# Altium schematic sheet ESP32_MCU.SchDoc
size A3; SheetNumber: 2; SheetTotal: 3
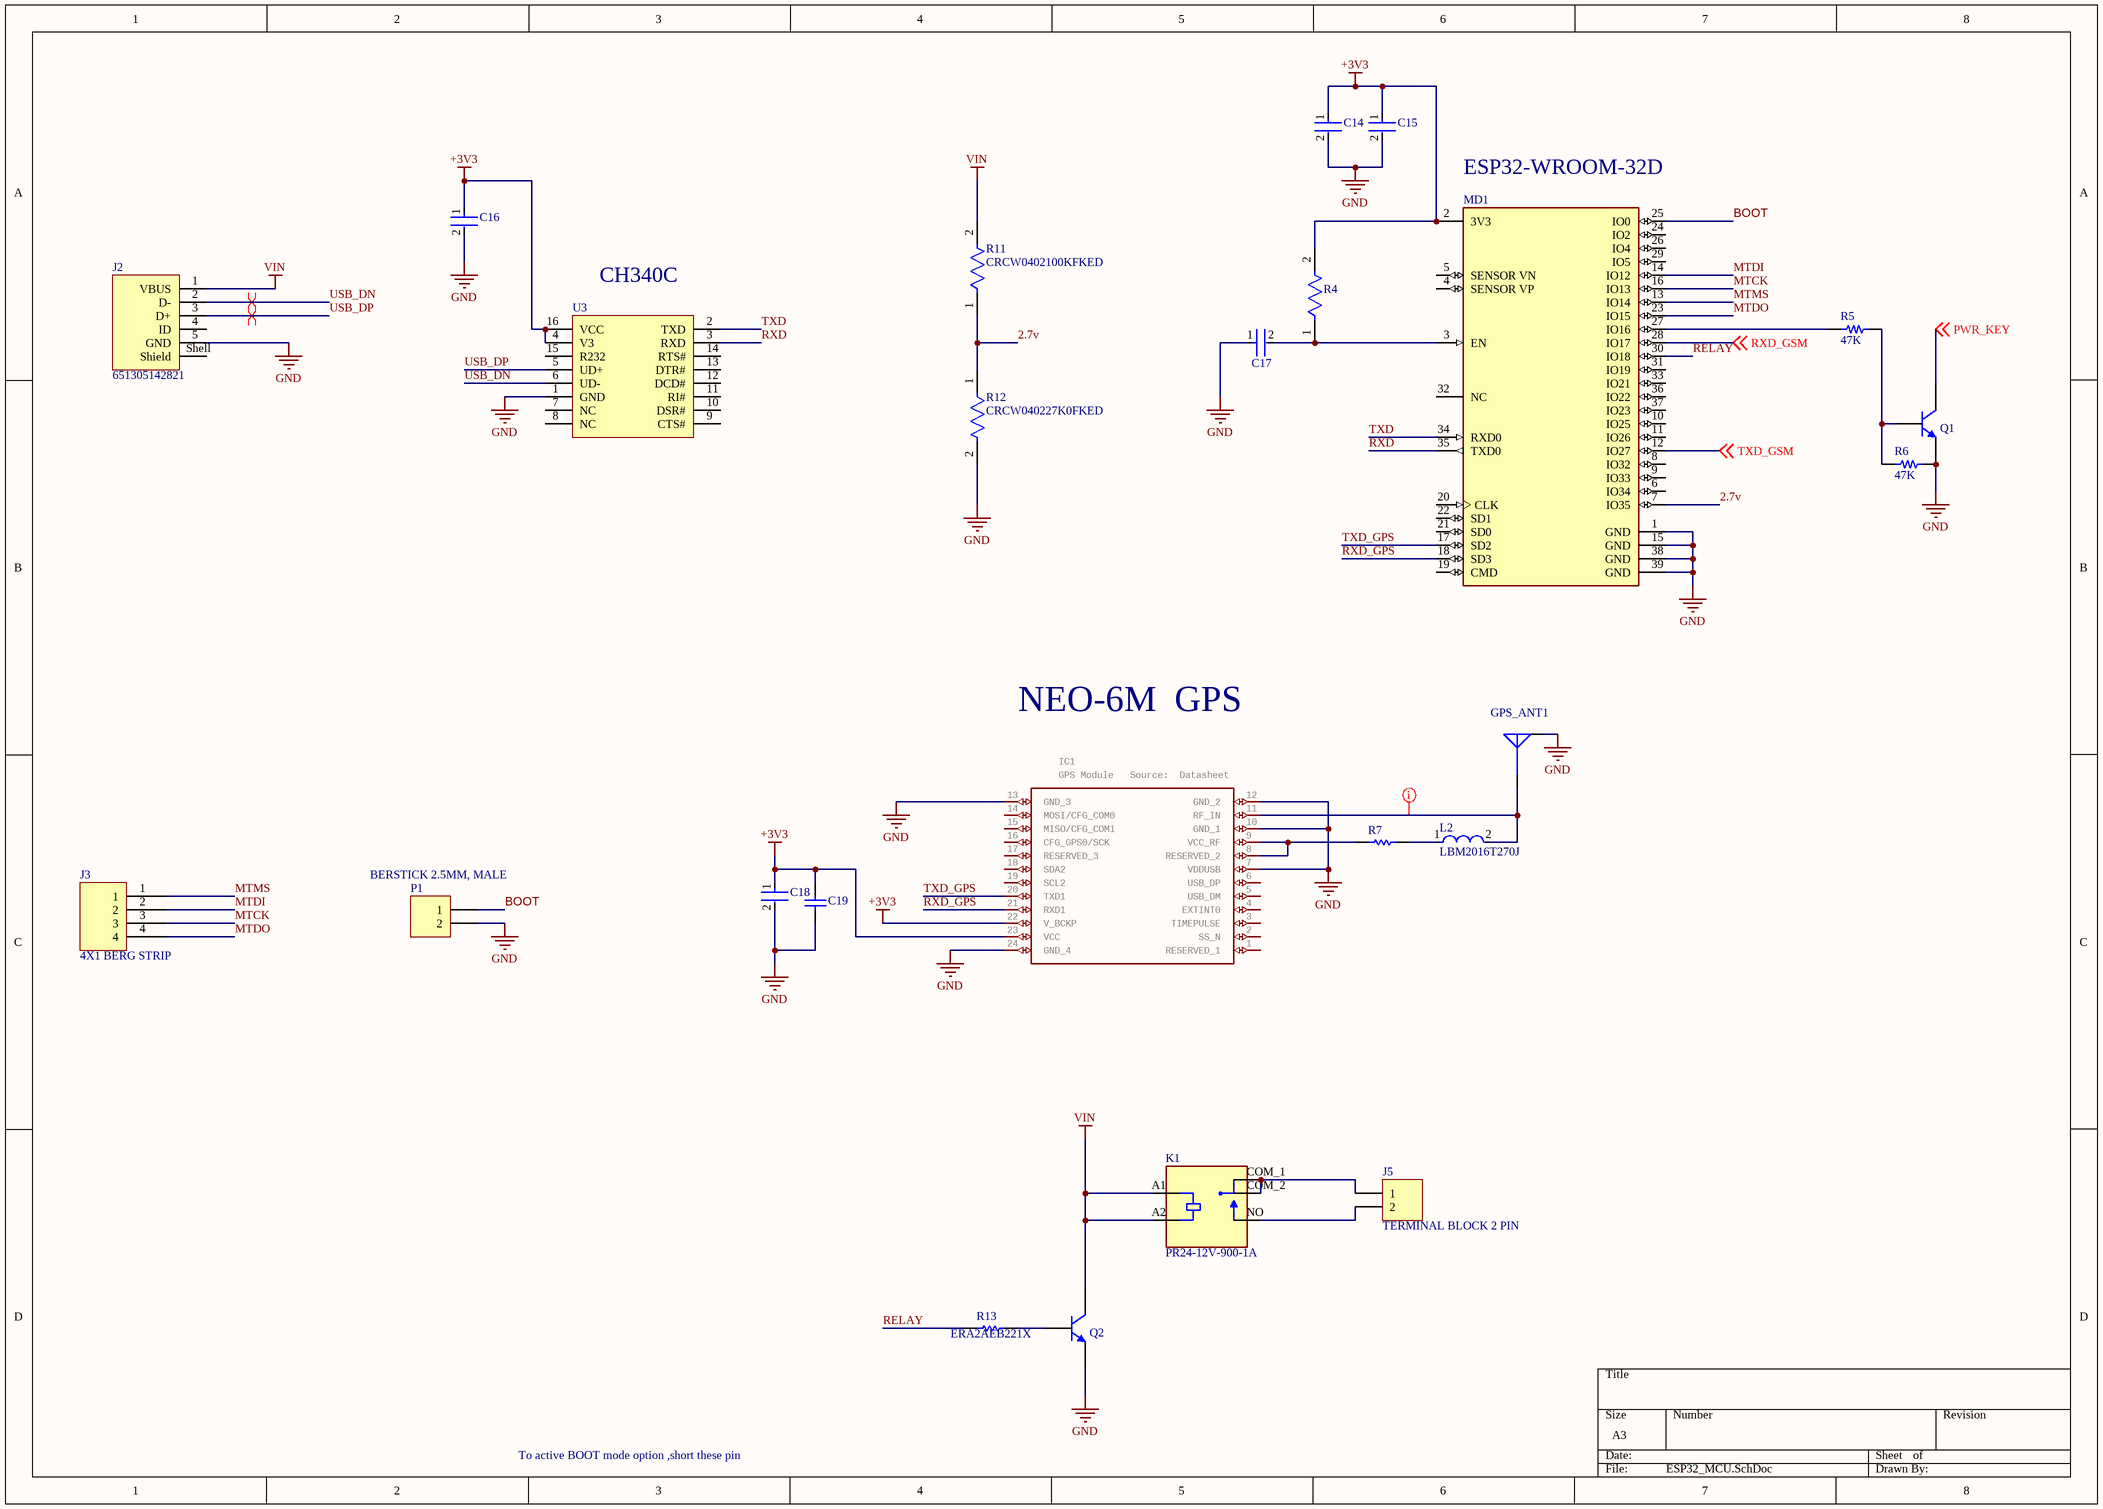
[diagram p0: ESP32_MCU.SchDoc]

## Parts
C14  C0402C104K8RACTU  [FP-C0402-BB-MFG]  (value not drawn)
C15  C0402C106M9PACTU  [FP-C0402C106M9PACTU-MFG]  (value not drawn)
C16  C0402C104K8RACTU  [FP-C0402-BB-MFG]  (value not drawn)
C17  CC0402KRX5R5BB105  [FP-CC0402-MFG]  (value not drawn)
C18  C0402C104K8RACTU  [FP-C0402-BB-MFG]  (value not drawn)
C19  C0402C475M7PACTU  [CAPC1005X60X30ML05T10]  (value not drawn)
GPS_ANT1  UFL  [MOLEX SD-734120110]  (value not drawn)
IC1  GPS Module   Source:  Datasheet  [NEO6M0001]
J2  651305142821  [651305142821]
J3  4X1 BERG STRIP  [CON4_100_40D72_TH_ST_MALE]
J5  TERMINAL BLOCK 2 PIN  [CON2_P196_1729128_TH_ST]
K1  PR24-12V-900-1A  [RELAY_PR24-12V-900-1A]
L2  LBM2016T270J  [FP-LBM2016-1_6-0_2-IPC_C]
MD1  ESP32-WROOM-32D  [FP-ESP32-WROOM-32D-MFG]
P1  BERSTICK 2.5MM, MALE  [CON2_100_43D62_TH_ST]
Q1  8050  [SOT-23-3 2.9X2.4MM P0.95MM]  (value not drawn)
Q2  8050  [SOT-23-3 2.9X2.4MM P0.95MM]  (value not drawn)
R4  CRCW040210K0JNED  [FP-CRCW0402-e3-IPC_B]  (value not drawn)
R5  47K  [RES 0603_1608]
R6  47K  [RES 0603_1608]
R7  CRCW040222R0FKED  [RESC1005X40X25LL05T05]  (value not drawn)
R11  CRCW0402100KFKED  [FP-CRCW0402-e3-IPC_C]
R12  CRCW040227K0FKED  [FP-CRCW0402-e3-IPC_A]
R13  ERA2AEB221X  [RESC1005X40X25LL10T10]
U3  CH340C  [SOIC16_50_284_25X90_SMT]

## Nets
+3V3: C14.1 C15.1 C16.1 C18.1 C19.2 IC1.22(V_BCKP) IC1.23(VCC) MD1.2(3V3) R4.2 U3.4(V3) U3.16(VCC)
GND: C14.2 C15.2 C16.2 C17.1 C18.2 C19.1 GPS_ANT1.G IC1.7(VDDUSB) IC1.10(GND_1) IC1.12(GND_2) IC1.13(GND_3) IC1.24(GND_4) J2.5(GND) MD1.1(GND) MD1.15(GND) MD1.38(GND) MD1.39(GND) P1.2 Q1.2(E) Q2.2(E) R6.1 R12.2 U3.1(GND)
VIN: J2.1(VBUS) K1.A1(COIL1) K1.A2(COIL2) Q2.3(C) R11.2
2.7v: MD1.7(IO35) R11.1 R12.1
BOOT: MD1.25(IO0) P1.1
MTCK: J3.3 MD1.16(IO13)
MTDI: J3.2 MD1.14(IO12)
MTDO: J3.4 MD1.23(IO15)
MTMS: J3.1 MD1.13(IO14)
PWR_KEY: Q1.3(C) ; off-sheet PWR_KEY
RELAY: MD1.30(IO18) R13.1
RXD: MD1.35(TXD0) U3.3(RXD)
RXD_GPS: IC1.21(RXD1) MD1.18(SD3)
RXD_GSM: MD1.28(IO17) ; off-sheet RXD_GSM
TXD: MD1.34(RXD0) U3.2(TXD)
TXD_GPS: IC1.20(TXD1) MD1.17(SD2)
TXD_GSM: MD1.12(IO27) ; off-sheet TXD_GSM
USB_DN: J2.2(D-) U3.6(UD-)
USB_DP: J2.3(D+) U3.5(UD+)
NetC17_2: C17.2 MD1.3(EN) R4.1
NetGPS_ANT1_S: GPS_ANT1.S IC1.11(RF_IN) L2.2
NetIC1_8: IC1.8(RESERVED_2) IC1.9(VCC_RF) R7.1
NetJ5_1: J5.1 K1.COM_1(COM1) K1.COM_2(COM2)
NetJ5_2: J5.2 K1.NO
NetL2_1: L2.1 R7.2
NetMD1_27: MD1.27(IO16) R5.2
NetQ1_1: Q1.1(B) R5.1 R6.2
NetQ2_1: Q2.1(B) R13.2

Not connected (* = marked no-connect by the designer): IC1 1(RESERVED_1) 2(SS_N) 3(TIMEPULSE) 4(EXTINT0) 5(USB_DM) 6(USB_DP) 14(MOSI/CFG_COM0) 15(MISO/CFG_COM1) 16(CFG_GPS0/SCK) 17(RESERVED_3) 18(SDA2) 19(SCL2); J2 4(ID) Shell(Shield); MD1 4(SENSOR_VP) 5(SENSOR_VN) 6(IO34) 8(IO32) 9(IO33) 10(IO25) 11(IO26) 19(CMD) 20(CLK) 21(SD0) 22(SD1) 24(IO2) 26(IO4) 29(IO5) 31(IO19) 32(NC) 33(IO21) 36(IO22) 37(IO23); U3 7(NC) 8(NC) 9(CTS#) 10(DSR#) 11(RI#) 12(DCD#) 13(DTR#) 14(RTS#) 15(R232)

## Layout directives
differential pair; differential pair class diff_90: USB_DN, USB_DP
net class GPS_ANT: NetGPS_ANT1_S

## Notes on the sheet
- NEO-6M  GPS
- To active BOOT mode option ,short these pin

## Library data of the parts
C14 C16 C18 = CMP-2008-03086-2: CAP CER 0.1UF 10V X7R 0402; Manufacturer: Kemet; Capacitance: 0.10 μF; Tolerance: 0.1; Temperature Coefficient: 15%; Value: 0.10 μF; Material: Ceramic; Automotive: No; Temperature Range High: +125°C; Octopart: https://octopart.com/c0402c104k8ractu-kemet-106349; ComponentLink2Description: Datasheet; ComponentLink2URL: https://content.kemet.com/datasheets/KEM_C1002_X7R_SMD.pdf; Temperature: -55°C to +125°C; RoHS: TRUE; Temperature Range Low: -55°C; Temperature Characteristic: X7R; Lead Free: Yes; Height: 0.55mm; Manufacturer Part Number: C0402C104K8RACTU; Voltage Rating: 10 V; Category: Cap; Device Class L3: Ceramic Capacitors; Digikey Description: CAP CER 0.1UF 10V X7R 0402; Package: C0402-BB; Device Class L1: Passive Components; Ipc Land Pattern Name: CAPC10050X50; Mouser Description: Multilayer Ceramic Capacitors MLCC - SMD/SMT 10volts 0.1uF X7R 10%; Device Class L2: Capacitors
C15 = CMP-03020-034678-1: CAP CER 10UF 6.3V X5R 0402; Tolerance: 20%; Dielectric Material: Ceramic; Voltage Rating: 6.3V; Thickness: 0.028inch; REACH SVHC: No SVHC; RoHS Compliant: Yes; Case Code (Metric): 1005; Lead Free: Lead Free; Length: 0.039inch; Max Operating Temperature: 85°C; Capacitance: 10uF; Voltage Rating (DC): 6.3V; Min Operating Temperature: -55°C; Case/Package: 0402; Mount: Surface Mount; Case Code (Imperial): 0402; Dielectric: X5R; Packaging: Cut Tape; Width: 0.02inch
C17 = CMP-2100-03591-2: CAP CER 1UF 6.3V X5R 0402; Manufacturer: YAGEO; Automotive Grade: NA; Material: Ceramic; Tolerance: 0.1; Temperature Coefficient: 30ppm/°C; Voltage Rating: 6.3 V; Temperature Range Low: -55°C; Digikey Description: CAP CER 1UF 6.3V X5R 0402; Capacitance: 1 uF; Height: 0.55mm; Automotive: No; ComponentLink2URL: http://www.yageo.com/documents/recent/UPY-GP_NP0_16V-to-50V_16.pdf; Device Class L2: Capacitors; RoHS: TRUE; Temperature Range High: +125°C; Device Class L3: Ceramic Capacitors; Device Class L1: Passive Components; Temperature Characteristic: X5R; Package: CC0402; Octopart: https://octopart.com/cc0402krx5r5bb105-yageo-42244618; ComponentLink2Description: Datasheet; Temperature: -55°C to +125°C; Manufacturer Part Number: CC0402KRX5R5BB105; Mouser Description: Multilayer Ceramic Capacitors MLCC - SMD/SMT 1uF 6.3V X5R 10%; Category: Cap; Footprint Url: http://www.yageo.com/exep/pages/download/literatures/UPY-C_GEN_24.pdf; Lead Free: Yes; Ipc Land Pattern Name: CAPC10050X50; Value: 1 uF
C19 = CMP-2008-02047-1: Manufacturer: Kemet; Part Number: C0402C475M7PACTU
GPS_ANT1 = UFL MOLEX SD-734120110: PartNumber: MOLEX SD-734120110
IC1 = NEO-6M-0-001: Manufacturer_Name: U-Blox; GateName_1: G$1; SymbolName_1: NEO-6M-0-001; LibraryName: NEO-6M-0-001; DeviceSetName: NEO-6M-0-001; Package: NEO6M0001; Manufacturer_Part_Number: NEO-6M-0-001; Height: 2.6mm
J2 = CMP-1502-03247-2: NexarPartId: 19991175; Operating Supply Voltage: 30V; Current Rating: 1A; Contact Resistance: 20mΩ; Connector Type: USB; Number of Contacts: 5; USB Standard: USB 2.0; Gender: Receptacle; Insulation Resistance: 1GΩ; REACH SVHC: Unknown; Contact Plating: Gold; Min Operating Temperature: -40°C; Features: Shielded; RoHS: Compliant; Contact Material: Copper; Packaging: Tape and Reel; Termination: SMD/SMT; Max Operating Temperature: 105°C; Orientation: Horizontal; Number of Pins: 5; Mount: Horizontal, Surface Mount; Lead Free: Lead Free
J3 = CON-BS-PLG_4X1-100-ST-TH: 4 Pins, 1 Row 2.54mm Pitch, Straight bergstrip, Male; Manufacturer: NA; Manufacturer Part Number: NA; Case/Package: TH-CON; Supplier-1: SP ROAD; Supplier Part Number-1: NA; Alternate Part Number-1: NA
J5 = CON-TB_2X1-196-ST-TH: 2 Pins, 1 Row 5mm Pitch, straight Connector, male; Manufacturer: Phoenix Contact; Manufacturer Part Number: MKDSN1,5/2; Alternate Part Number-1: NA; Case/Package: TH-CON; Supplier-1: SP ROAD; Supplier Part Number-1: MKDSN1,5/2
K1 = PR24-12V-900-1A: 27.4 x 31.8 x 20 mm, 12 V, 40 A, SPST (1 Form A), Power Relay; MF: CUI Devices; SnapEDA_Link: https://www.snapeda.com/parts/PR24-12V-900-1A/CUI+Devices/view-part/?ref=snap; Package: None; Value: *; CUI_purchase_URL: https://www.cuidevices.com/product/relays/power-relays/pr24-12v-900-1a?utm_source=snapeda.com&utm_medium=referral&utm_campaign=snapedaBOM; MP: PR24-12V-900-1A; Check_prices: https://www.snapeda.com/parts/PR24-12V-900-1A/CUI+Devices/view-part/?ref=eda
L2 = CMP-14484-001072-1: SMD Inductors 27uH ±5% 0.13A 4.16Ω 0806; Shielding: Unshielded; DC Current: 130mA; DC Resistance (DCR): 3.2R; Q Factor: 25; Self Resonant Frequency: 16MHz; Test Frequency: 2.52MHz; Core Material: Ferrite; Height: 1.6mm; Package Quantity: 2000; RoHS Compliant: Yes; Height - Seated (Max): 0.071inch; Tolerance: 5%; Max Operating Temperature: 105°C; Inductance Tolerance: 5%; Depth: 1.8mm; Length: 2mm; Mount: Surface Mount; Radiation Hardening: No; Width: 0.063inch; Packaging: Tape and Reel; Inductance: 27uH; Termination: SMD/SMT; Lead Free: Lead Free; Case Code (Imperial): 0806; Max DC Current: 130mA; Military Standard: Not; Series: LB; Current Rating: 130mA; Case Code (Metric): 2016; Resistor Type: Wirewound; Halogen Free: Halogen Free; Case/Package: 0806; Min Operating Temperature: -40°C
MD1 = CMP-194065-000003-1: WIFI MODULE 32MBITS SPI FLASH; Manufacturer: Espressif Systems; Max Supply Voltage: 3.6V; Nominal Supply Current: 500mA; Max Frequency: 2484MHz; Number Of Adc Channels: 16; Number Of Gpio: 32; Interface: I2C,SPI,UART,Ethernet,I2S,Other; Data Rate: 150Mbits/s; Min Supply Voltage: 3V; Bandwidth: 72MHz; Sensitivity: -98dBm; Octopart: https://octopart.com/esp32-wroom-32d-espressif+systems-91040050; Package: ESP32-WROOM-32D; ComponentLink2URL: https://www.espressif.com/sites/default/files/documentation/esp32-wroom-32d_esp32-wroom-32u_datasheet_en.pdf; Lead Free: Yes; Category: UNK; Mouser Description: Wi-Fi/BT BLE Module ESP32-D0WD, SPI Flash, UART, P; Device Class L1: Integrated Circuits (ICs); RoHS: TRUE; Temperature Range Low: -40°C; ComponentLink2Description: Datasheet; Digikey Description: WIFI MODULE 32MBITS SPI FLASH; Height: 3.2mm; Temperature: -40°C to +85°C; Manufacturer Part Number: ESP32-WROOM-32D; Device Class L3: Transceivers; Device Class L2: RF Semiconductors and Devices; Temperature Range High: +85°C; Automotive: No
P1 = CON-BS-PLG_2X1-100-ST-TH: 2 Pins, 1 Row 2.54mm Pitch, Straight bergstrip, Male; Manufacturer Part Number: NA; Manufacturer: Samtec; Case/Package: TH-CON; Supplier-1: SP ROAD; Supplier Part Number-1: NA; Alternate Part Number-1: NA
Q1 Q2 = MMSS8050 (SMD): Bipolar (BJT) Transistor NPN 25V 1.5A 100MHz 625mW Surface Mount SOT-23; PartNumber: MMSS8050-L-TP
R4 = CMP-2002-08136-3: RES Thick Film, 10kΩ, 5%, 0.063W, 200ppm/°C, 0402; Voltage Rating: 50V; Power Rating: 63mW; Resistance: 10kR; Military Standard: Not; Packaging: Tape and Reel; Case Code (Imperial): 0402; Min Operating Temperature: -55°C; Case Code (Metric): 1005; Case/Package: 0402; Temperature Coefficient: 200ppm/°C; Termination: SMD/SMT; Composition: Thick Film; Depth: 0.5mm; Number of Terminations: 2; Contact Plating: Tin; Height: 0.016inch; Width: 0.5mm; Max Operating Temperature: 155°C; Features: Automotive AEC-Q200; Length: 1mm; Radiation Hardening: No; Max Power Dissipation: 63mW; Mount: Surface Mount; Tolerance: 5%; Package Quantity: 1; Weight: 2.3E-05oz
R5 R6 = Res 0603: SMT Resistor; VALUE: 1K
R7 = CMP-2002-08382-1: Manufacturer: Vishay Dale; Part Number: CRCW040222R0FKED
R11 = CMP-2002-08123-3: RES Thick Film, 100kΩ, 1%, 0.063W, 100ppm/°C, 0402; Power Rating: 63mW; Resistance: 100kR; Voltage Rating (DC): 50V; Lead Free: Lead Free; Height: 0.35mm; Contact Plating: Tin; Min Operating Temperature: -55°C; Package Quantity: 10000; Case/Package: 0402; Temperature Coefficient: 100ppm/°C; Number of Terminations: 2; Packaging: Tape and Reel; Max Power Dissipation: 63mW; Case Code (Metric): 1005; Mount: Surface Mount; Width: 0.02inch; Termination: SMD/SMT; Length: 1mm; Number of Pins: 2; Weight: 2.3E-05oz; Radiation Hardening: No; Tolerance: 1%; Military Standard: Not; Features: Automotive AEC-Q200; Depth: 0.5mm; Composition: Thick Film; Max Operating Temperature: 155°C; Voltage Rating: 50V; Case Code (Imperial): 0402
R12 = CMP-2002-08431-2: RES Thick Film, 27kΩ, 1%, 0.063W, 100ppm/°C, 0402; Resistance: 27kR; Power Rating: 63mW; Voltage Rating: 50V; Military Standard: Not; Height: 0.35mm; Packaging: Tape and Reel; Case/Package: 0402; Temperature Coefficient: 100ppm/°C; Composition: Thick Film; Mount: Surface Mount; Features: Automotive AEC-Q200; Tolerance: 1%; Contact Plating: Tin; Radiation Hardening: No; Depth: 0.5mm; Termination: SMD/SMT; Width: 0.02inch; Package Quantity: 10; Min Operating Temperature: -55°C; Case Code (Metric): 1005; Lead Free: Lead Free; Voltage Rating (DC): 50V; Max Operating Temperature: 155°C; Weight: 2.3E-05oz; Case Code (Imperial): 0402; Length: 1mm; Number of Terminations: 2; Max Power Dissipation: 63mW; Number of Pins: 2
R13 = CMP-2002-05880-1: Manufacturer: Panasonic; Part Number: ERA2AEB221X
U3 = IC_CH340C: USB Bridge, USB to UART USB 2.0 UART Interface; Manufacturer: Olimex; Alternate Part Number-1: NA; Manufacturer Part Number: CH340C; Case/Package: SOIC16; Supplier-1: LCSC; Supplier Part Number-1: C84681